# Altium schematic sheet gsm1.SchDoc
size A4
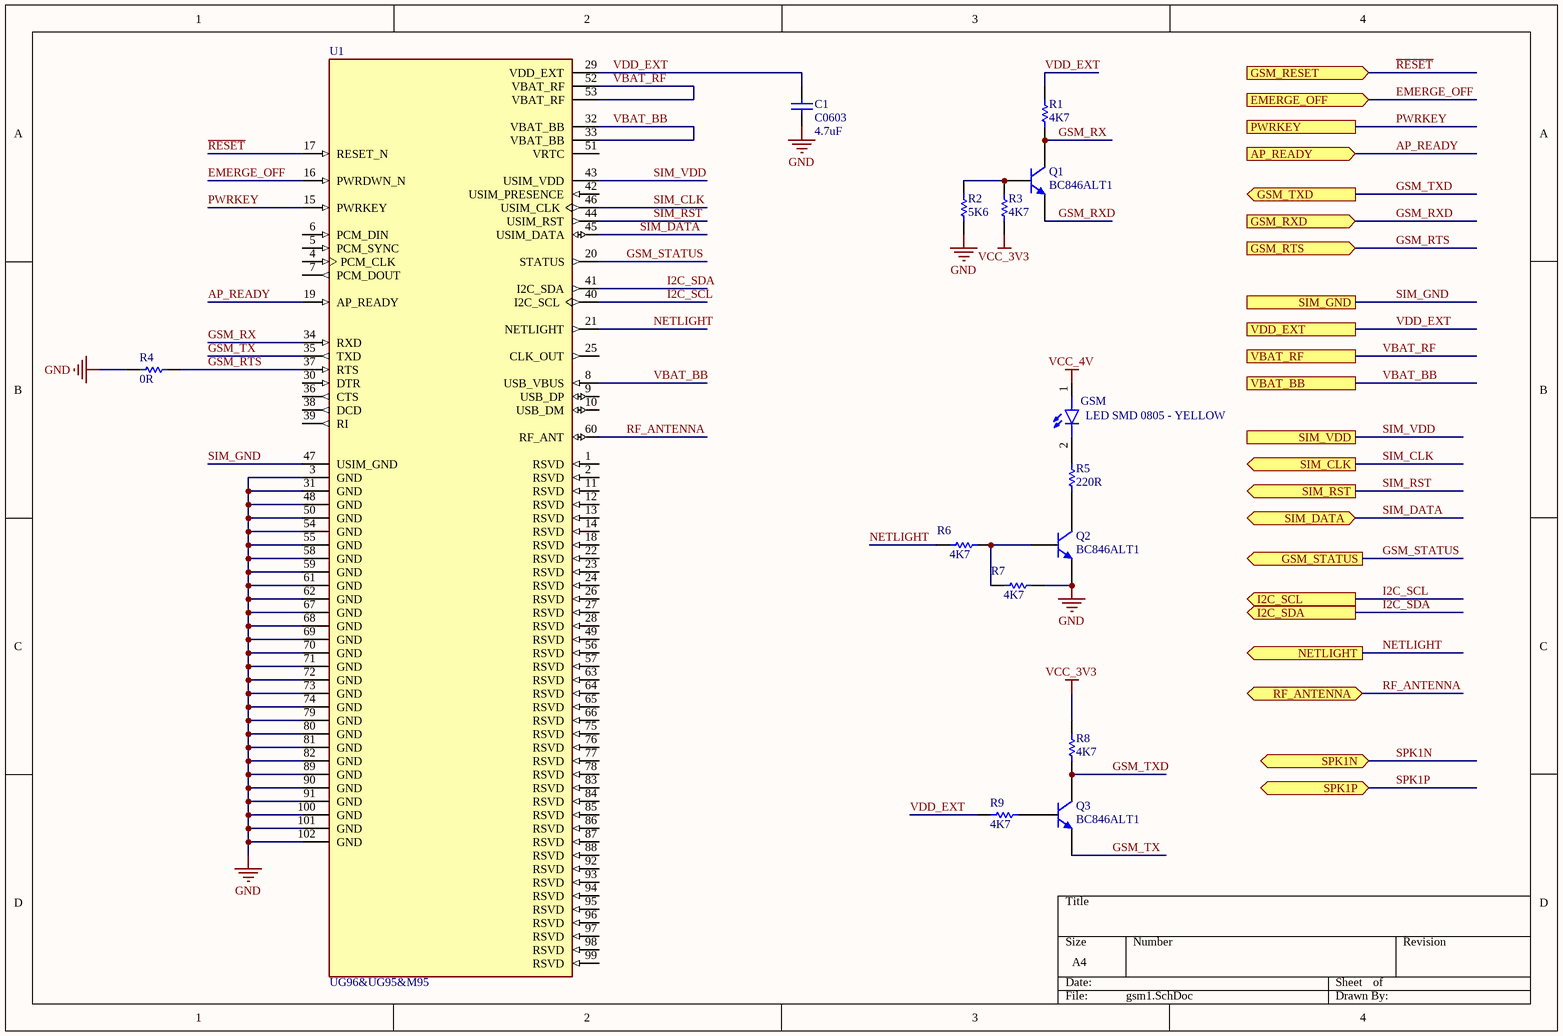
[diagram p0: gsm1.SchDoc]

## Parts
C1  C0603  value 4.7uF  [C0603]
GSM  LED SMD 0805 - YELLOW  [LED SMD 0805 - YELLOW]
Q1  BC846ALT1  [BC846]
Q2  BC846ALT1  [BC846]
Q3  BC846ALT1  [BC846]
R1  value 4K7  [CC1608-0603]  (hidden comment: Res0603)
R2  value 5K6  [CC1608-0603]  (hidden comment: Res0603)
R3  value 4K7  [CC1608-0603]  (hidden comment: Res0603)
R4  value 0R  [CC1608-0603]  (hidden comment: Res0603)
R5  value 220R  [CC1608-0603]  (hidden comment: Res0603)
R6  value 4K7  [CC1608-0603]  (hidden comment: Res0603)
R7  value 4K7  [CC1608-0603]  (hidden comment: Res0603)
R8  value 4K7  [CC1608-0603]  (hidden comment: Res0603)
R9  value 4K7  [CC1608-0603]  (hidden comment: Res0603)
U1  UG96&UG95&M95  [UG96&UG95&M95]

## Ports
AP_READY (in), EMERGE_OFF (in), GSM_RESET (in), GSM_RTS (in), GSM_RXD (in), GSM_STATUS (out), GSM_TXD (out), I2C_SCL (out), I2C_SDA (out), NETLIGHT (out), PWRKEY, RF_ANTENNA (bidir), SIM_CLK (out), SIM_DATA (bidir), SIM_GND, SIM_RST (out), SIM_VDD, SPK1N (bidir), SPK1P (bidir), VBAT_BB, VBAT_RF, VDD_EXT

## Nets
GND: C1.1 Q2.2(E) R2.1 R4.1 R7.2 U1.3(GND) U1.31(GND) U1.48(GND) U1.50(GND) U1.54(GND) U1.55(GND) U1.58(GND) U1.59(GND) U1.61(GND) U1.62(GND) U1.67(GND) U1.68(GND) U1.69(GND) U1.70(GND) U1.71(GND) U1.72(GND) U1.73(GND) U1.74(GND) U1.79(GND) U1.80(GND) U1.81(GND) U1.82(GND) U1.89(GND) U1.90(GND) U1.91(GND) U1.100(GND) U1.101(GND) U1.102(GND)
VCC_3V3: R3.1 R8.2
VCC_4V: GSM.1
AP_READY: U1.19(AP_READY) ; port AP_READY
EMERGE_OFF: U1.16(PWRDWN_N) ; port EMERGE_OFF
GSM_RTS: R4.2 U1.37(RTS) ; port GSM_RTS
GSM_RX: Q1.3(C) R1.1 U1.34(RXD)
GSM_RXD: Q1.2(E) ; port GSM_RXD
GSM_STATUS: U1.20(STATUS) ; port GSM_STATUS
GSM_TX: Q3.2(E) U1.35(TXD)
GSM_TXD: Q3.3(C) R8.1 ; port GSM_TXD
I2C_SCL: U1.40(I2C_SCL) ; port I2C_SCL
I2C_SDA: U1.41(I2C_SDA) ; port I2C_SDA
NETLIGHT: R6.1 U1.21(NETLIGHT) ; port NETLIGHT
PWRKEY: U1.15(PWRKEY) ; port PWRKEY
~{RESET}: U1.17(RESET_N) ; port GSM_RESET
RF_ANTENNA: U1.60(RF_ANT) ; port RF_ANTENNA
SIM_CLK: U1.46(USIM_CLK) ; port SIM_CLK
SIM_DATA: U1.45(USIM_DATA) ; port SIM_DATA
SIM_GND: U1.47(USIM_GND) ; port SIM_GND
SIM_RST: U1.44(USIM_RST) ; port SIM_RST
SIM_VDD: U1.43(USIM_VDD) ; port SIM_VDD
SPK1N: port SPK1N
SPK1P: port SPK1P
VBAT_BB: U1.8(USB_VBUS) U1.32(VBAT_BB) U1.33(VBAT_BB) ; port VBAT_BB
VBAT_RF: U1.52(VBAT_RF) U1.53(VBAT_RF) ; port VBAT_RF
VDD_EXT: C1.2 R1.2 R9.2 U1.29(VDD_EXT) ; port VDD_EXT
NetGSM_2: GSM.2 R5.2
NetQ1_1: Q1.1(B) R2.2 R3.2
NetQ2_1: Q2.1(B) R6.2 R7.1
NetQ2_3: Q2.3(C) R5.1
NetQ3_1: Q3.1(B) R9.1

Not connected (* = marked no-connect by the designer): U1 1(RSVD) 2(RSVD) 4(PCM_CLK) 5(PCM_SYNC) 6(PCM_DIN) 7(PCM_DOUT) 9(USB_DP) 10(USB_DM) 11(RSVD) 12(RSVD) 13(RSVD) 14(RSVD) 18(RSVD) 22(RSVD) 23(RSVD) 24(RSVD) 25(CLK_OUT) 26(RSVD) 27(RSVD) 28(RSVD) 30(DTR) 36(CTS) 38(DCD) 39(RI) 42(USIM_PRESENCE) 49(RSVD) 51(VRTC) 56(RSVD) 57(RSVD) 63(RSVD) 64(RSVD) 65(RSVD) 66(RSVD) 75(RSVD) 76(RSVD) 77(RSVD) 78(RSVD) 83(RSVD) 84(RSVD) 85(RSVD) 86(RSVD) 87(RSVD) 88(RSVD) 92(RSVD) 93(RSVD) 94(RSVD) 95(RSVD) 96(RSVD) 97(RSVD) 98(RSVD) 99(RSVD)

## Library data of the parts
C1 = C0603: Ceramic Chip Capacitor - Standard; Note: Footprint corresponds to dimensions for bulk cassette packaging. This case size has tightened tolerances.; Published: 17-Jul-2002; LatestRevisionDate: 19-Mar-2004; LatestRevisionNote: Silkscreen size reduced.; DatasheetDocument: Mar-2001; PackageDocument: Mar-2001; PackageReference: 0603; Publisher: Altium Limited; Code_JEITA: 0603; Code_IPC: 1608 [0603]; ComponentLink1Description: Manufacturer Link; ComponentLink1URL: http://www.kemet.com/; ComponentLink2Description: Datasheet; ComponentLink2URL: http://www.kemet.com/kemet/web/homepage/kechome.nsf/vapubfilesname/F3102TA.pdf/$file/F3102TA.pdf
Q1-Q3 = BC846ALT1: General Purpose Transistor NPN Silicon; Published: 29-Sep-2000; LatestRevisionDate: 17-Jul-2002; LatestRevisionNote: Re-released for DXP Platform.; DatasheetVersion: 1997; PackageVersion: 1997; PackageReference: 318-08; Publisher: Altium Limited; PackageDescription: SOT-23; 3 Leads; Body 3.0 x 2.6 mm, inc. leads (LxW max); ComponentLink1Description: Manufacturer Link; ComponentLink1URL: http://www.onsemi.com/site/products/landing?taxonomyID=194; ComponentLink2Description: Datasheet; ComponentLink2URL: http://www.onsemi.com/pub/Collateral/BC846ALT1-D.PDF
R1-R9 = Res0603: Resistor; Manufacturer: Generic Components; Class I: Passive; Published: 8-Jun-2000; Revision: July-2002: Re-released for DXP Platform.; Publisher: Altium Limited; Class II: Resistor